# Altium schematic sheet GPS.SchDoc
size A3; Organization: Altium Limited; Address1: L3, 12a Rodborough Rd; Address2: Frenchs Forest; Address3: NSW; Address4: Australia 2086
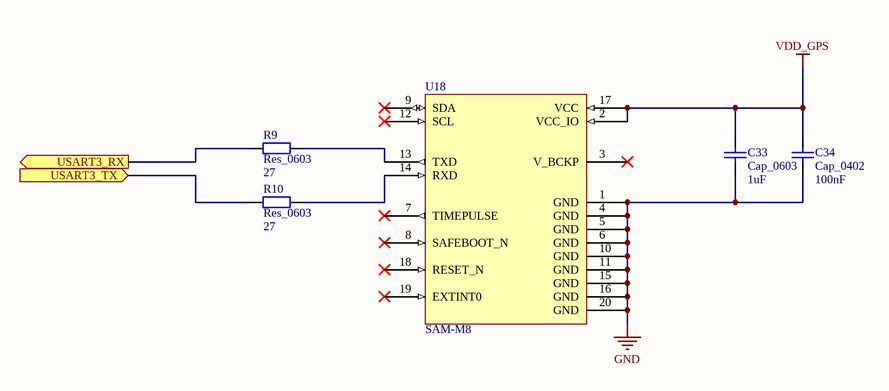
[diagram p0: GPS.SchDoc]

## Parts
C33  Cap_0603  value 1uF  [0603]
C34  Cap_0402  value 100nF  [0402]
R9  Res_0603  value 27  [0603]
R10  Res_0603  value 27  [0603]
U18  SAM-M8  [SAM-M8]

## Ports
USART3_RX (out), USART3_TX (in)

## Nets
GND: C33.1 C34.1 U18.1(GND) U18.4(GND) U18.5(GND) U18.6(GND) U18.10(GND) U18.11(GND) U18.15(GND) U18.16(GND) U18.20(GND)
VDD_GPS: C33.2 C34.2 U18.2(VCC_IO) U18.17(VCC)
USART3_RX: R9.1 ; port USART3_RX
USART3_TX: R10.1 ; port USART3_TX
NetR9_2: R9.2 U18.13(TXD)
NetR10_2: R10.2 U18.14(RXD)

Not connected (* = marked no-connect by the designer): U18 3(V_BCKP)* 7(TIMEPULSE)* 8(SAFEBOOT_N)* 9(SDA)* 12(SCL)* 18(RESET_N)* 19(EXTINT0)*

## Notes on the sheet
- Title
- Size:
- Date:
- A3
- Number:
- Time:
- Revision:
- Sheet
- of
- File:

## Library data of the parts
C33 = Cap_0603: Capacitor; Published: 8-Jun-2000; LatestRevisionDate: 17-Jul-2002; LatestRevisionNote: Re-released for DXP Platform.; PackageReference: RAD-0.3; Publisher: Altium Limited; PackageDescription: Radial Cap, Thru-Hole; 2 Leads; 0.3 in Pin Spacing
C34 = Cap_0402: Capacitor; Published: 8-Jun-2000; LatestRevisionDate: 17-Jul-2002; LatestRevisionNote: Re-released for DXP Platform.; PackageReference: RAD-0.3; Publisher: Altium Limited; PackageDescription: Radial Cap, Thru-Hole; 2 Leads; 0.3 in Pin Spacing
R9 R10 = Res_0603: Resistor; Published: 8-Jun-2000; LatestRevisionDate: 17-Jul-2002; LatestRevisionNote: Re-released for DXP Platform.; PackageReference: AXIAL-0.4; Publisher: Altium Limited; PackageDescription: Axial Device, Thru-Hole; 2 Leads; 0.4 in Pin Spacing
U18 = SAM-M8: GNSS moduleS